# Altium schematic sheet toplevel.SchDoc: The Things Node Toplevel
size A4; DocumentNumber: 1; SheetNumber: 1; SheetTotal: 3
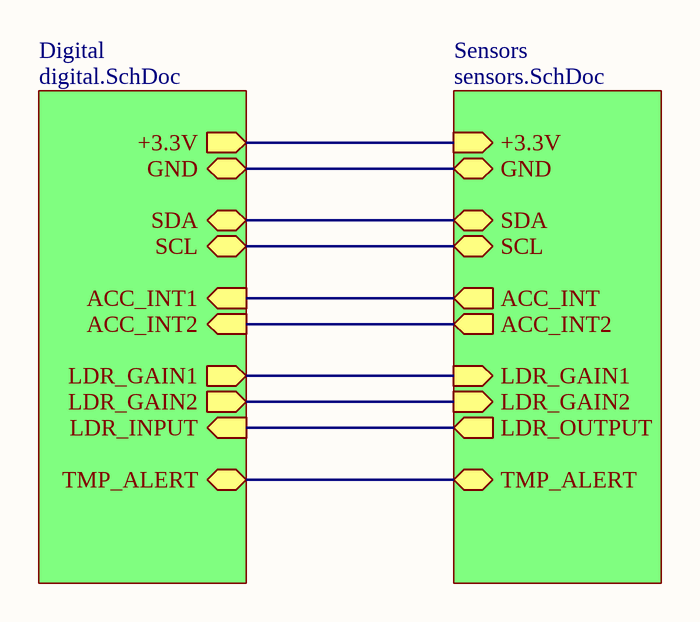
[diagram p0: toplevel.SchDoc]

## Sub-sheets
Digital = digital.SchDoc: +3.3V (out), GND (bidir), ACC_INT1 (in), SDA, SCL, LDR_GAIN1 (out), LDR_INPUT (in), LDR_GAIN2 (out), ACC_INT2 (in), TMP_ALERT
Sensors = sensors.SchDoc: +3.3V (in), GND (bidir), ACC_INT (out), SDA, SCL, LDR_GAIN1 (in), LDR_OUTPUT (out), LDR_GAIN2 (in), ACC_INT2 (out), TMP_ALERT

## Nets
(unnamed): sheet Digital/+3.3V, sheet Sensors/+3.3V
(unnamed): sheet Digital/GND, sheet Sensors/GND
(unnamed): sheet Digital/ACC_INT1, sheet Sensors/ACC_INT
(unnamed): sheet Digital/SDA, sheet Sensors/SDA
(unnamed): sheet Digital/SCL, sheet Sensors/SCL
(unnamed): sheet Digital/LDR_GAIN1, sheet Sensors/LDR_GAIN1
(unnamed): sheet Digital/LDR_INPUT, sheet Sensors/LDR_OUTPUT
(unnamed): sheet Digital/LDR_GAIN2, sheet Sensors/LDR_GAIN2
(unnamed): sheet Digital/ACC_INT2, sheet Sensors/ACC_INT2
(unnamed): sheet Digital/TMP_ALERT, sheet Sensors/TMP_ALERT

## Notes on the sheet
- Title
- Size:
- Date:
- A4
- Number:
- Time:
- Revision:
- Sheet
- of
- The Things Products
- Project:
- File: